# Altium schematic sheet ETHERNET PHY.SchDoc: ETHERNET PHY
size A4; Organization: Altium Limited; Address1: L3, 12a Rodborough Rd; Address2: Frenchs Forest; Address3: NSW; Address4: Australia 2086; DocumentNumber: 6; SheetNumber: 6; SheetTotal: 11
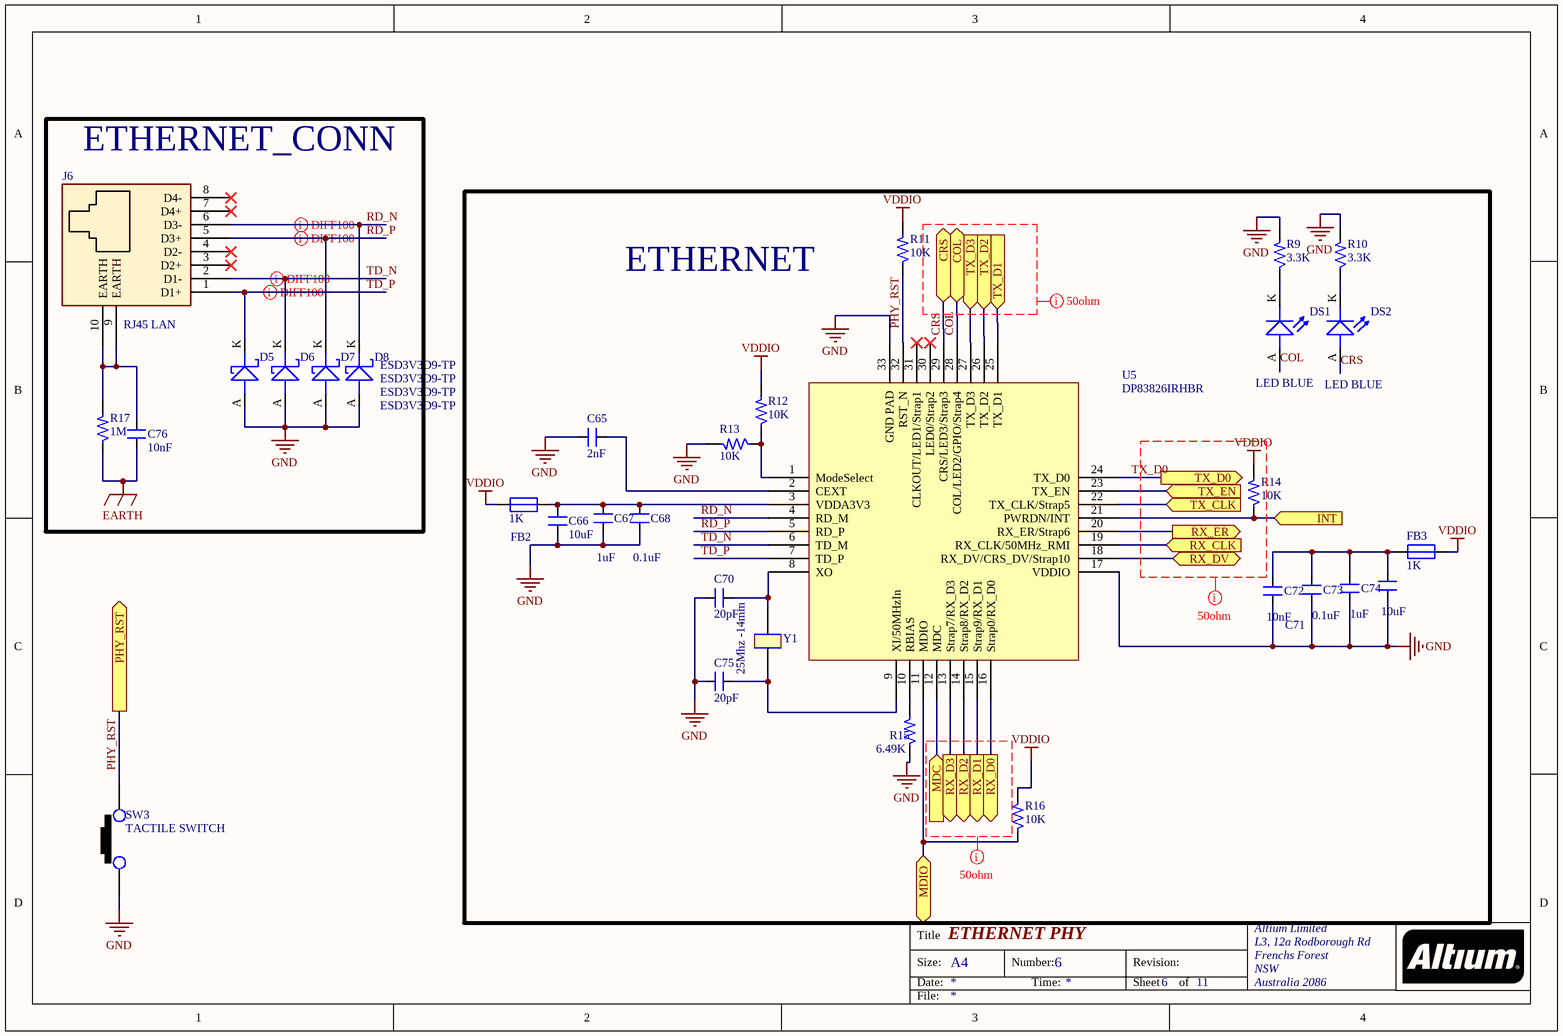
[diagram p0: ETHERNET PHY.SchDoc]

## Parts
C65  2nF  [CAP_0805]
C66  10uF  [CAP_1206]
C67  1uF  [CAP_0805]
C68  0.1uF  [CAP_0805]
C70  20pF  [CAP_0805]
C71  10uF  [CAP_1206]
C72  10nF  [CAP_P196_102X287_H332_RAD_TH]
C73  0.1uF  [CAP_0805]
C74  1uF  [CAP_0805]
C75  20pF  [CAP_0805]
C76  10nF  [CAP_P196_102X287_H332_RAD_TH]
D5  ESD3V3D9-TP  [DIO_SOD-923]
D6  ESD3V3D9-TP  [DIO_SOD-923]
D7  ESD3V3D9-TP  [DIO_SOD-923]
D8  ESD3V3D9-TP  [DIO_SOD-923]
DS1  LED BLUE  [LED_0805]
DS2  LED BLUE  [LED_0805]
FB2  1K  [IND_0805]
FB3  1K  [IND_0805]
J6  RJ45 LAN  [CON10_P106_RJ45_TH_ST]
R9  3.3K  [RES_0805]
R10  3.3K  [RES_0805]
R11  10K  [RES_0805]
R12  10K  [RES_0805]
R13  10K  [RES_0805]
R14  10K  [RES_0805]
R15  6.49K  [RES_0805]
R16  10K  [RES_0805]
R17  1M  [RES_0805]
SW3  TACTILE SWITCH  [SW_342_SMD]
U5  DP83826IRHBR  [VQFN32_19_218_23X9_SMD]
Y1  25Mhz -14mm  [XTAL_314_240X47_SMD]

## Blocks framed on the sheet
ETHERNET_CONN: C76 D5-D8 J6 R17
ETHERNET: C65-C68 C70-C75 DS1 DS2 FB2 FB3 R9-R16 U5 Y1

## Ports
COL (bidir), CRS (bidir), INT (in), MDC (in), MDIO (bidir), PHY_RST (out), RX_CLK (in), RX_D0 (out), RX_D1 (out), RX_D2 (out), RX_D3 (out), RX_DV (bidir), RX_ER (out), TX_CLK (in), TX_D0 (out), TX_D1 (in), TX_D2 (in), TX_D3 (in), TX_EN (in)

## Nets
EARTH: C76.1 R17.1
GND: C65.2 C66.1 C67.1 C68.1 C70.2 C71.2 C72.2 C73.2 C74.2 C75.2 D5.A D6.A D7.A D8.A R9.2 R10.2 R13.2 R15.1 SW3.1 U5.17(VDDIO) U5.33(GND_PAD)
VDDIO: FB2.1 FB3.2 R11.2 R12.2 R14.2 R16.2
COL: DS1.A(ANODE) U5.28(COL/LED2/GPIO/Strap4) ; port COL
CRS: DS2.A(ANODE) U5.29(CRS/LED3/Strap3) ; port CRS
INT: R14.1 U5.21(PWRDN/INT) ; port INT
MDC: U5.12(MDC) ; port MDC
MDIO: R16.1 U5.11(MDIO) ; port MDIO
PHY_RST: R11.1 SW3.2 U5.32(RST_N) ; port PHY_RST
RD_N: D8.K J6.6(D3-) U5.4(RD_M)
RD_P: D7.K J6.5(D3+) U5.5(RD_P)
RX_CLK: U5.19(RX_CLK/50MHz_RMI) ; port RX_CLK
RX_D0: U5.16(Strap0/RX_D0) ; port RX_D0
RX_D1: U5.15(Strap9/RX_D1) ; port RX_D1
RX_D2: U5.14(Strap8/RX_D2) ; port RX_D2
RX_D3: U5.13(Strap7/RX_D3) ; port RX_D3
RX_DV: U5.18(RX_DV/CRS_DV/Strap10) ; port RX_DV
RX_ER: U5.20(RX_ER/Strap6) ; port RX_ER
TD_N: D6.K J6.2(D1-) U5.6(TD_M)
TD_P: D5.K J6.1(D1+) U5.7(TD_P)
TX_CLK: U5.22(TX_CLK/Strap5) ; port TX_CLK
TX_D0: U5.24(TX_D0) ; port TX_D0
TX_D1: U5.25(TX_D1) ; port TX_D1
TX_D2: U5.26(TX_D2) ; port TX_D2
TX_D3: U5.27(TX_D3) ; port TX_D3
TX_EN: U5.23(TX_EN) ; port TX_EN
NetC65_1: C65.1 U5.2(CEXT)
NetC66_2: C66.2 C67.2 C68.2 FB2.2 U5.3(VDDA3V3)
NetC70_1: C70.1 U5.8(XO) Y1.2
NetC71_1: C71.1 C72.1 C73.1 C74.1 FB3.1
NetC75_1: C75.1 U5.9(XI/50MHzIn) Y1.1
NetC76_2: C76.2 J6.9(EARTH) J6.10(EARTH) R17.2
NetDS1_K: DS1.K(CATHODE) R9.1
NetDS2_K: DS2.K(CATHODE) R10.1
NetR12_1: R12.1 R13.1 U5.1(ModeSelect)
NetR15_2: R15.2 U5.10(RBIAS)

Not connected (* = marked no-connect by the designer): J6 3(D2+)* 4(D2-)* 7(D4+)* 8(D4-)*; U5 30(LED0/Strap2)* 31(CLKOUT/LED1/Strap1)*

## Layout directives
differential pair; differential pair class DIFF100: RD_N, RD_P, TD_N
differential pair; net class DIFF100: TD_P
net class 50OHM: (no net found under the mark), VDDIO

## Notes on the sheet
- Title
- Size:
- Date:
- A4
- Number:
- Time:
- Revision:
- Sheet
- of
- File:

## Library data of the parts
C65 = CAP_2nF-50V-10%-0805: 2000pF ±10% 50V Ceramic Capacitor X7R 0805 (2012 Metric); Manufacturer: Samsung Electro-Mechanics; Manufacturer Part Number: CL21B202KBANNNC; Alternate Part Number-1: NA; Case/Package: 0805; Supplier-1: Digikey; Supplier Part Number-1: 1276-2471-1-ND - Cut Tape (CT)
C66 C71 = CAP_10uF-50V-10%-1206: 10µF ±10% 50V Ceramic Capacitor X7R 1206 (3216 Metric); Manufacturer: KEMET; Manufacturer Part Number: CL31B106KBHNNNE; Alternate Part Number-1: GRT31CR61H106ME01L; Case/Package: 1206; Supplier-1: SIRICOM; Supplier Part Number-1: CC1206KKX5R9BB106
C67 C74 = CAP_1uF-50V-5%-0805: 1µF ±5% 50V Ceramic Capacitor X7R 0805 (2012 Metric); Manufacturer: Samsung; Manufacturer Part Number: CC0805JKX7R9BB105; Alternate Part Number-1: 0805F105M500NT; Case/Package: 0805; Supplier-1: SIRICOM; Supplier Part Number-1: CL21B105KBFNNNE
C68 C73 = CAP_0.1uF-50V-5%-0805: 0.1µF ±5% 50V Ceramic Capacitor X7R 0805 (2012 Metric); Manufacturer: AVX Corporation; Manufacturer Part Number: 08055C104JAT4A; Alternate Part Number-1: 0805B104M500; Case/Package: 0805; Supplier-1: SIRICOM; Supplier Part Number-1: 0805B104J500CT
C70 C75 = CAP_20pF-50V-10%-0805: ±10% 50V Ceramic Capacitor C0G, NP0 0805 (2012 Metric); Manufacturer: AVX Corporation; Manufacturer Part Number: 08055A200KAT2A; Alternate Part Number-1: NA; Case/Package: 0805; Supplier-1: Digikey; Supplier Part Number-1: 478-11887-1-ND - Cut Tape (CT)
C72 C76 = CAP_10nF-1KV-10%-RAD-TH: 10000pF ±10% 1000V (1kV) Ceramic Capacitor X7R Radial; Manufacturer: Yageo; Manufacturer Part Number: RDER73A103K2K1H03B; Alternate Part Number-1: NA; Case/Package: TH; Supplier-1: SP ROAD; Supplier Part Number-1: RDER73A103K2K1H03B
D5-D8 = DIO-T_3.3V-8.8V-SOD923: 8.8V Clamp 5A (8/20µs) Ipp Tvs Diode Surface Mount SOD-923; Manufacturer: Micro Commercial Co; Alternate Part Number-1: NA; Manufacturer Part Number: ESD3V3D9-TP; Case/Package: SOD923; Supplier-1: Digikey; Supplier Part Number-1: ESD3V3D9-TPMSCT-ND - Cut Tape (CT)
DS1 DS2 = LED_BLUE-3V3-20mA-0805: Blue 470nm LED Indication - Discrete 3.3V 0805 (2012 Metric); Manufacturer: Vishay Lite-On; Manufacturer Part Number: LTST-C171TBKT; Alternate Part Number-1: NA; Case/Package: 0805; Supplier-1: SP ROAD; Supplier Part Number-1: LTST-C171TBKT
FB2 FB3 = FB_1K-100MHZ-1.6A-0805: 1 kOhms @ 100MHz 1 Power Line Ferrite Bead 0805 (2012 Metric) 1.6A; Manufacturer: Laird; Manufacturer Part Number: BLM21SP102SH1D; Alternate Part Number-1: NA; Case/Package: 0805; Supplier-1: SIRICOM; Supplier Part Number-1: ACMS201209A102
J6 = CON-SKT-RJ_8C8P-RA-TH: 8 Pins, 2 Row 2.54mm Pitch, right angle Connector, male; Manufacturer: Assmann; Manufacturer Part Number: A-2004-2-4-LPS-N-R; Alternate Part Number-1: NA; Case/Package: TH-CON; Supplier-1: SP ROAD; Supplier Part Number-1: A-2004-2-4-LPS-N-R
R9 R10 = RES_3.3K-0.125W-1%-0805: 3.3 kOhms ±1% 0.125W, 1/8W Chip Resistor 0805 (2012 Metric) Thick Film; Manufacturer: Panasonic; Manufacturer Part Number: 1623214-1; Alternate Part Number-1: 0805W8F3301T5E; Case/Package: 0805; Supplier-1: SIRICOM; Supplier Part Number-1: WR08X3301FTL
R11-R14 R16 = RES_10K-0.125W-1%-0805: 10 kOhms ±1% 0.125W, 1/8W Chip Resistor 0805 (2012 Metric) Automotive AEC-Q200 Thick Film; Manufacturer: CTS; Manufacturer Part Number: WR08X1002FTL; Case/Package: 0805; Supplier-1: SIRICOM; Supplier Part Number-1: WR08X1002FTL; Alternate Part Number-1: WR08X1002FTL
R15 = RES_6.49K-0.125W-1%-0805: 6.49 kOhms ±1% 0.125W, 1/8W Chip Resistor 0805 (2012 Metric) Moisture Resistant Thick Film; Manufacturer: Stackpole Electronics; Manufacturer Part Number: RC0805FR-076K49L; Alternate Part Number-1: NA; Case/Package: 0805; Supplier-1: SIRICOM; Supplier Part Number-1: WRO8X6491FTL
R17 = RES_1M-0.125W-1%-0805: 1 MOhms ±1% 0.125W, 1/8W Chip Resistor 0805 (2012 Metric) Automotive AEC-Q200 Thick Film; Manufacturer: Walsin; Manufacturer Part Number: WR08X1004FTL; Alternate Part Number-1: 0805W8F1004T5E; Case/Package: 0805; Supplier-1: SIRICOM; Supplier Part Number-1: WR08X1004FTL
SW3 = SW1_RS-282G05A3-SMRT-SMD: Tactile Switch SPST-NO Top Actuated Surface Mount; Manufacturer: ITT C&K; Alternate Part Number-1: NA; Manufacturer Part Number: RS-282G05A3-SMRT; Case/Package: SMD; Supplier-1: SP ROAD; Supplier Part Number-1: RS-282G05A3-SMRT
U5 = IC_DP83826IRHBR: Ethernet ICs Low latency 10/100-Mbps PHY, MII interface and enhanced mode with an industrial temperature range 32-VQFN -40 to 85; Manufacturer: Texas Instruments; Alternate Part Number-1: NA; Manufacturer Part Number: DP83826IRHBR; Case/Package: 32-VQFN; Supplier-1: Mouser; Supplier Part Number-1: 595-DP83826IRHBR
Y1 = XTAL_25Mhz-FOXSDLF/250F-20: 25MHz ±30ppm Crystal 20pF 30 Ohms HC-49/US; Manufacturer: Abracon; Alternate Part Number-1: NA; Manufacturer Part Number: FOXSDLF/250F-20; Case/Package: SMD; Supplier-1: MOUSER; Supplier Part Number-1: FOXSDLF/250F-20